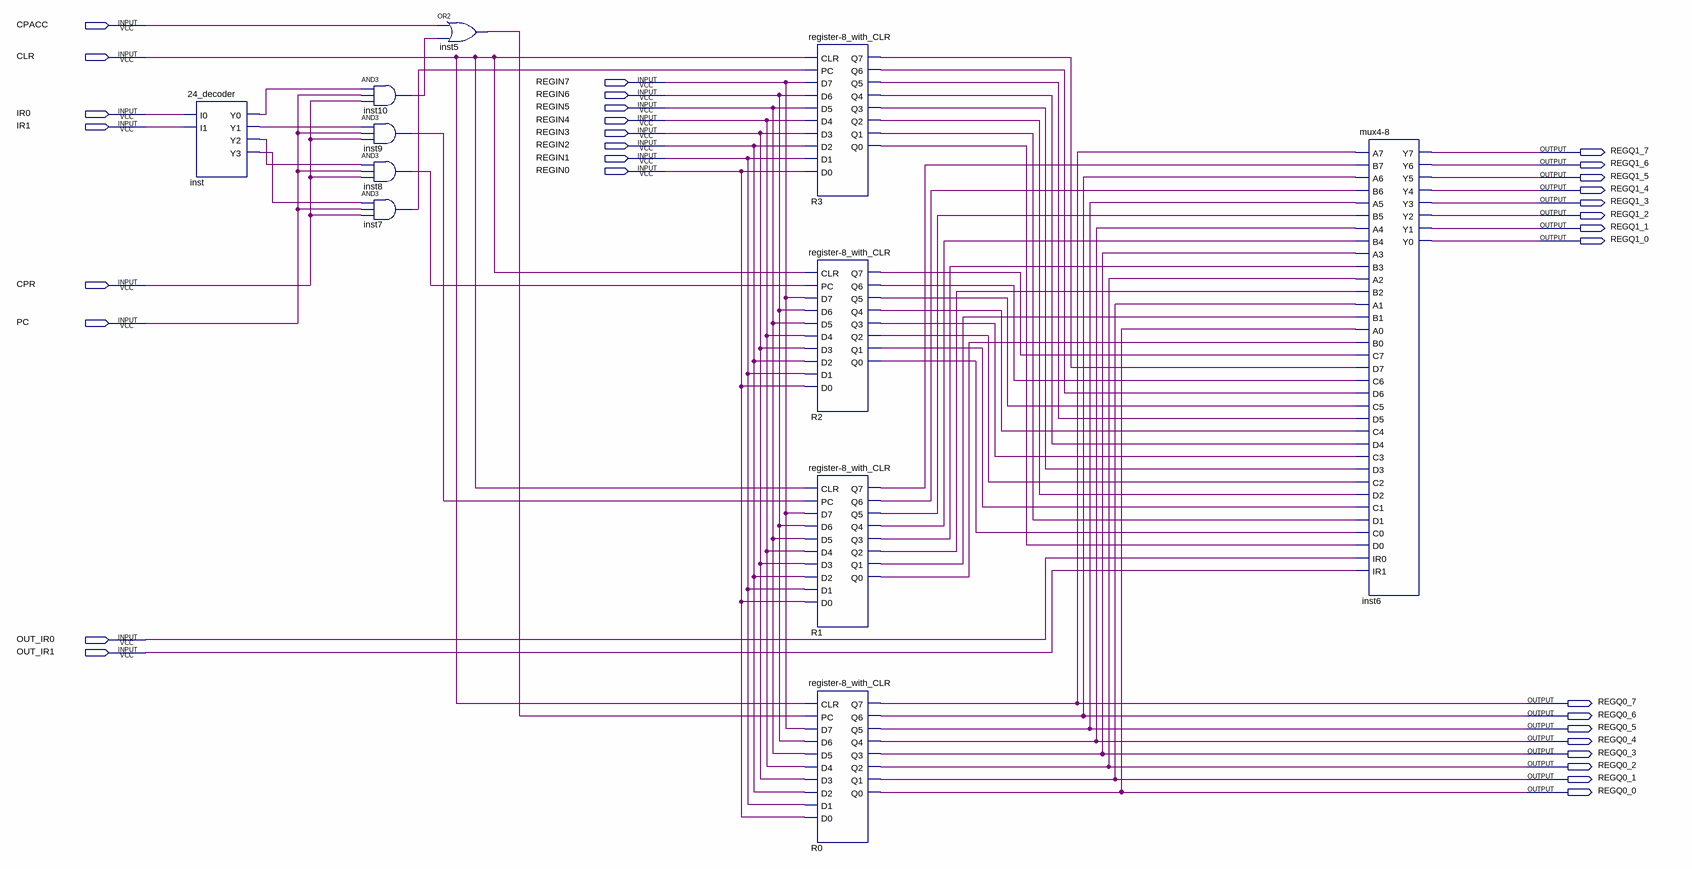
[diagram p0: schematic sheet]
// Quartus schematic register_4x.bdf as structural Verilog: 11 symbols, 32 pins
module register_4x (
  input  CPACC,
  input  CLR,
  input  REGIN7,
  input  REGIN6,
  input  REGIN5,
  input  IR0,
  input  REGIN4,
  input  IR1,
  input  REGIN3,
  input  REGIN2,
  input  REGIN1,
  input  REGIN0,
  input  CPR,
  input  PC,
  input  OUT_IR0,
  input  OUT_IR1,
  output REGQ1_7,
  output REGQ1_6,
  output REGQ1_5,
  output REGQ1_4,
  output REGQ1_3,
  output REGQ1_2,
  output REGQ1_1,
  output REGQ1_0,
  output REGQ0_7,
  output REGQ0_6,
  output REGQ0_5,
  output REGQ0_4,
  output REGQ0_3,
  output REGQ0_2,
  output REGQ0_1,
  output REGQ0_0
);

  wire inst5_out, inst7_out, inst8_out, inst9_out, inst10_out, inst_y0, inst_y1, inst_y2, inst_y3, R1_q0,
       R1_q1, R1_q2, R1_q3, R1_q4, R1_q5, R1_q6, R1_q7, R2_q0, R2_q1, R2_q2, R2_q3, R2_q4, R2_q5, R2_q6,
       R2_q7, R3_q0, R3_q1, R3_q2, R3_q3, R3_q4, R3_q5, R3_q6, R3_q7;

  \24_decoder  inst (.I0(IR0), .I1(IR1), .Y0(inst_y0), .Y1(inst_y1), .Y2(inst_y2), .Y3(inst_y3));
  and inst10 (inst10_out, inst_y0, PC, CPR);
  and inst9 (inst9_out, inst_y1, PC, CPR);
  and inst8 (inst8_out, inst_y2, PC, CPR);
  and inst7 (inst7_out, inst_y3, PC, CPR);
  or inst5 (inst5_out, CPACC, inst10_out);
  \register-8_with_CLR  R3 (
    .CLR(CLR), .PC(inst7_out), .D7(REGIN7), .D6(REGIN6), .D5(REGIN5), .D4(REGIN4), .D3(REGIN3), .D2(REGIN2),
    .D1(REGIN1), .D0(REGIN0), .Q7(R3_q7), .Q6(R3_q6), .Q5(R3_q5), .Q4(R3_q4), .Q3(R3_q3), .Q2(R3_q2),
    .Q1(R3_q1), .Q0(R3_q0));
  \register-8_with_CLR  R2 (
    .CLR(CLR), .PC(inst8_out), .D7(REGIN7), .D6(REGIN6), .D5(REGIN5), .D4(REGIN4), .D3(REGIN3), .D2(REGIN2),
    .D1(REGIN1), .D0(REGIN0), .Q7(R2_q7), .Q6(R2_q6), .Q5(R2_q5), .Q4(R2_q4), .Q3(R2_q3), .Q2(R2_q2),
    .Q1(R2_q1), .Q0(R2_q0));
  \register-8_with_CLR  R1 (
    .CLR(CLR), .PC(inst9_out), .D7(REGIN7), .D6(REGIN6), .D5(REGIN5), .D4(REGIN4), .D3(REGIN3), .D2(REGIN2),
    .D1(REGIN1), .D0(REGIN0), .Q7(R1_q7), .Q6(R1_q6), .Q5(R1_q5), .Q4(R1_q4), .Q3(R1_q3), .Q2(R1_q2),
    .Q1(R1_q1), .Q0(R1_q0));
  \register-8_with_CLR  R0 (
    .CLR(CLR), .PC(inst5_out), .D7(REGIN7), .D6(REGIN6), .D5(REGIN5), .D4(REGIN4), .D3(REGIN3), .D2(REGIN2),
    .D1(REGIN1), .D0(REGIN0), .Q7(REGQ0_7), .Q6(REGQ0_6), .Q5(REGQ0_5), .Q4(REGQ0_4), .Q3(REGQ0_3),
    .Q2(REGQ0_2), .Q1(REGQ0_1), .Q0(REGQ0_0));
  \mux4-8  inst6 (
    .A7(REGQ0_7), .B7(R1_q7), .A6(REGQ0_6), .B6(R1_q6), .A5(REGQ0_5), .B5(R1_q5), .A4(REGQ0_4), .B4(R1_q4),
    .A3(REGQ0_3), .B3(R1_q3), .A2(REGQ0_2), .B2(R1_q2), .A1(REGQ0_1), .B1(R1_q1), .A0(REGQ0_0), .B0(R1_q0),
    .C7(R2_q7), .D7(R3_q7), .C6(R2_q6), .D6(R3_q6), .C5(R2_q5), .D5(R3_q5), .C4(R2_q4), .D4(R3_q4),
    .C3(R2_q3), .D3(R3_q3), .C2(R2_q2), .D2(R3_q2), .C1(R2_q1), .D1(R3_q1), .C0(R2_q0), .D0(R3_q0),
    .IR0(OUT_IR0), .IR1(OUT_IR1), .Y7(REGQ1_7), .Y6(REGQ1_6), .Y5(REGQ1_5), .Y4(REGQ1_4), .Y3(REGQ1_3),
    .Y2(REGQ1_2), .Y1(REGQ1_1), .Y0(REGQ1_0));
endmodule
